# Altium project TIDA-010967_xWRL6432AOP_Module_revB.PrjPcb (part 3 of 3)

## Sheet TIDA-010967_Decoupling_caps.SchDoc: DECOUPLING_CAPS
size 431 x 279 mm; Date: Not shown in title block; ApprovedBy: Not shown in title block; CheckedBy: Not shown in title block; Author: Not shown in title block; CompanyName: Not shown in title block; DrawnBy: Justin Yin; Engineer: Not shown in title block; Organization: Not shown in title block; Address1: Not shown in title block; Address2: Not shown in title block; Address3: Not shown in title block; Address4: Not shown in title block; DocumentNumber: 6; Revision: Use project parameter SCH_Rev; SheetNumber: 6; SheetTotal: 8; PageSetup: Record=PageOptions|CenterHorizontal=True|CenterVertical=True|PrintScale=1.00|XCorrection=1.00|YCorrection=1.00|PrintKind=0|BorderSize=5000000|LeftOffset=0|BottomOffset=0|Orientation=2|PaperLength=1000|PaperWidth=1000|Scale=100|PaperSource=15|PrintQuality=600|MediaType=1|DitherType=10|PaperKind=Letter|PrintScaleMode=1; CurrentTime: Not shown in title block; CurrentDate: Not shown in title block; Time: Not shown in title block; DocumentFullPathAndName: Not shown in title block; DocumentName: Not shown in title block; ModifiedDate: Not shown in title block; ImagePath: Not shown in title block
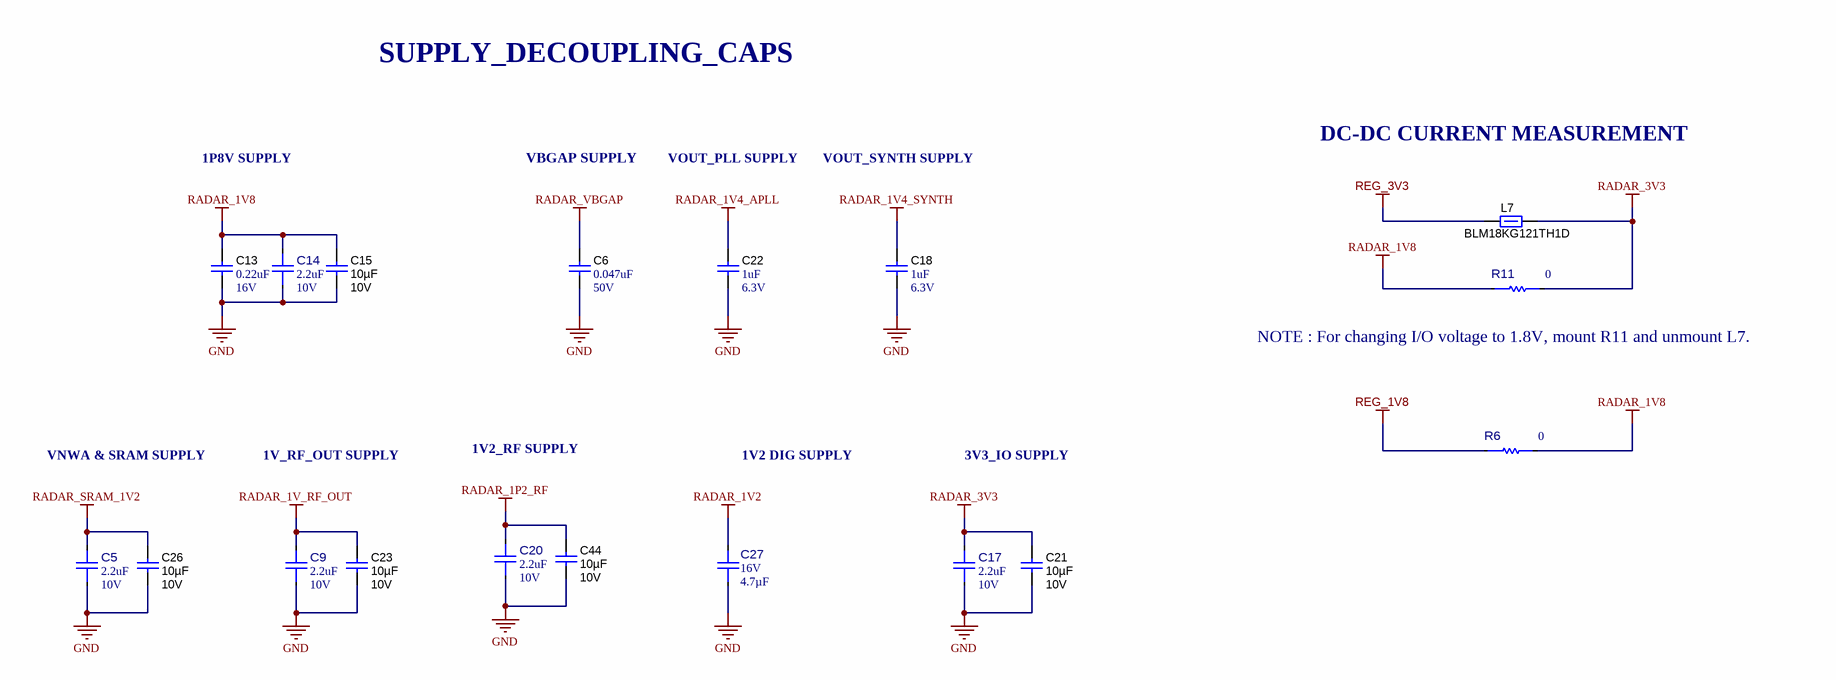
[diagram p5: TIDA-010967_Decoupling_caps.SchDoc]

### Parts
C5  ValueDisplayed: 2.2uF  VDC_V: 10V  [FP-GRM155R61A225ME01D_0402-MFG]  (hidden comment: GRM155R61A225ME01D)
C6  VDC_V: 50V  ValueDisplayed: 0.047uF  [0402L]  (hidden comment: C1005X7R1H473K050BB)
C9  ValueDisplayed: 2.2uF  VDC_V: 10V  [FP-GRM155R61A225ME01D_0402-MFG]  (hidden comment: GRM155R61A225ME01D)
C13  VDC_V: 16V  ValueDisplayed: 0.22uF  [0402L]  (hidden comment: GRM155R71C224KA12D)
C14  ValueDisplayed: 2.2uF  VDC_V: 10V  [FP-GRM155R61A225ME01D_0402-MFG]  (hidden comment: GRM155R61A225ME01D)
C15  Value2: 10V  Cap_F: 10µF  [0603L]  (hidden comment: GRM188Z71A106MA73D)
C17  ValueDisplayed: 2.2uF  VDC_V: 10V  [FP-GRM155R61A225ME01D_0402-MFG]  (hidden comment: GRM155R61A225ME01D)
C18  VDC_V: 6.3V  ValueDisplayed: 1uF  [0402S]  (hidden comment: GRM155R70J105KA12D)
C20  ValueDisplayed: 2.2uF  VDC_V: 10V  [FP-GRM155R61A225ME01D_0402-MFG]  (hidden comment: GRM155R61A225ME01D)
C21  Value2: 10V  Cap_F: 10µF  [0603L]  (hidden comment: GRM188Z71A106MA73D)
C22  VDC_V: 6.3V  ValueDisplayed: 1uF  [0402S]  (hidden comment: GRM155R70J105KA12D)
C23  Value2: 10V  Cap_F: 10µF  [0603L]  (hidden comment: GRM188Z71A106MA73D)
C26  Value2: 10V  Cap_F: 10µF  [0603L]  (hidden comment: GRM188Z71A106MA73D)
C27  VDC_V: 16V  Cap_F: 4.7µF  [FP-GCJ21BR71C475KA01L_0805-MFG]  (hidden comment: GCJ21BR71C475KA01L)
C44  Value2: 10V  Cap_F: 10µF  [0603L]  (hidden comment: GRM188Z71A106MA73D)
L7  BLM18KG121TH1D  [0603L]
R6  Res_ohm: 0  [FP-ERJ-3GEY0R00V_0603-MFG]  (hidden comment: ERJ-3GEY0R00V)
R11  Res_ohm: 0  [FP-ERJ-3GEY0R00V_0603-MFG]  (hidden comment: ERJ-3GEY0R00V)

### Nets
GND: C5.1 C6.2 C9.1 C13.2 C14.1 C15.2 C17.1 C18.2 C20.1 C21.2 C22.2 C23.2 C26.2 C27.1 C44.2
RADAR_1P2_RF: C20.2 C44.1
RADAR_1V2: C27.2
RADAR_1V4_APLL: C22.1
RADAR_1V4_SYNTH: C18.1
RADAR_1V8: C13.1 C14.2 C15.1 R6.2 R11.1
RADAR_1V_RF_OUT: C9.2 C23.1
RADAR_3V3: C17.2 C21.1 L7.2 R11.2
RADAR_SRAM_1V2: C5.2 C26.1
RADAR_VBGAP: C6.1
REG_1V8: R6.1
REG_3V3: L7.1

### Notes on the sheet
- SUPPLY_DECOUPLING_CAPS
- DC-DC CURRENT MEASUREMENT
- 1P8V SUPPLY
- VBGAP SUPPLY
- VOUT_PLL SUPPLY
- VOUT_SYNTH SUPPLY
- (near R11) NOTE : For changing I/O voltage to 1.8V, mount R11 and unmount L7.
- VNWA & SRAM SUPPLY
- 1V_RF_OUT SUPPLY
- 1V2_RF SUPPLY
- 1V2 DIG SUPPLY
- 3V3_IO SUPPLY
- Drawn By:
- SVN Rev:
- Number:
- TID #:
- Orderable:
- Rev:
- Sheet Title:
- File:
- Project Title:
- Designed for:
- Assembly Variant:
- Mod. Date:
- Sheet:
- Size:
- of
- B
- http://www.ti.com
- Texas Instruments and/or its licensors do not warrant the accuracy or completeness of this specification or any information contained therein. Texas Instruments and/or its licensors do not warrant that this design will meet the specifications, will be suitable for your application or fit for any particular purpose, or will operate in an implementation. Texas Instruments and/or its licensors do not warrant that the design is production worthy. You should completely validate and test your design implementation to confirm the system functionality for your application.
- Engineer:
- Contact:
- © Texas Instruments

### Library data of the parts
C5 C9 C14 C17 C20 = CMP-0097887-1: Chip Multilayer Ceramic Capacitors for General Purpose, 0402, 2.2uF, X5R, 15%, 20%, 10V; Manufacturer: Murata; SizeZ_mm: 0.55mm; Value: 2.2µF; AEC Qualified: No; ComponentLink1URL: https://www.murata.com/en-us/products/productdetail?partno=GRM155R61A225ME01%23; PartNumber: GRM155R61A225ME01D; RoHS: TRUE; Temperature Characteristic: X5R; datasheet: https://www.murata.com/en-us/products/productdetail?partno=GRM155R61A225ME01%23; PackageReference: 0402; Part Number: GRM155R61A225ME01D; Lead Free: Yes; Operating Temperature Range: -55°C to +85°C; ComponentLink1Description: Datasheet; Tolerance_%: 20%; helpURL: https://upverter.com/upn/revision/9c1060debce10243/; Datasheet Path: datasheets/Cap-GRM155R61A225ME01D.pdf; TempCo: 15%; Cap_F: 2.2µF
C6 = CMP-0006298-2: CAP, CERM, 0.047 uF, 50 V, +/- 10%, X7R, 0402; Manufacturer: TDK; TaMin_C: -55°C; ESR_ohm: 0.06407; Polarized: N; SizeAreaWB_mm2: 3; Value1: 0.06407 ohm; U/M: EA; SizeZ_mm: 0.6; SizeX_mm: 1; SizeY_mm: 0.5; Cap_Case: 0402; Cap_F: 47nF; IRMS_A: 6.46122dA; AEC Category: Q200; TaMax_C: 125°C; Supplier Part Number 2: 04X3233; Publisher: Texas Instruments; Supplier 2: Newark; Supplier Part Number 3: 810-C1005X7R1H473K; TempCo: X7R; Supplier 3: Mouser; Published: 2008-06-19; RoHS: Y; MountType: SMT; Value: 0.047uF; Supplier 1: Digi-Key; PackageReference: 0402; Tolerance_%: 10%; Value2: 50V; SizeArea_mm2: 0.5; CompType: Capacitor; LatestRevisionDate: 2017-03-09; PartNumber: C1005X7R1H473K050BB; AEC Qualified: N; ComponentLink1Description: Datasheet link; AEC Grade: N/A; Supplier Part Number 1: 445-7336-1-ND; Technology: Ceramic; ComponentLink1URL: https://product.tdk.com/en/search/capacitor/ceramic/mlcc/info?part_no=C1005X7R1H473K050BB
C13 = CMP-0006648-2: CAP, CERM, 0.22 uF, 16 V, +/- 10%, X7R, 0402; Manufacturer: MuRata; TaMin_C: -55°C; Polarized: N; SizeAreaWB_mm2: 3; Value1: Unknown; U/M: EA; Value: 0.22uF; TaMax_C: 125°C; SizeZ_mm: 0.6; SizeX_mm: 1; SizeY_mm: 0.5; Cap_Case: 0402; Cap_F: 220nF; AEC Category: Q200; Supplier Part Number 2: 81-GRM155R71C224KA2D; Publisher: Texas Instruments; Supplier 2: Mouser; TempCo: X7R; Published: 2008-06-19; RoHS: Y; MountType: SMT; Supplier 1: Digi-Key; PackageReference: 0402; Tolerance_%: 10%; Value2: 16V; SizeArea_mm2: 0.5; CompType: Capacitor; LatestRevisionDate: 2017-03-09; PartNumber: GRM155R71C224KA12D; AEC Qualified: ?; ComponentLink1Description: Datasheet link; Supplier Part Number 1: 490-5418-1-ND; Technology: Ceramic; ComponentLink1URL: http://search.murata.co.jp/Ceramy/PnsearchViewAction.do?HnOFG=ON&HnNFG=ON&SEL_CNT=50&sLang=en&sKey=GRM155R71C224KA12D&x=9&y=9&search=startwith
C15 C21 C23 C26 C44 = CMP-0007497-5: CAP, CERM, 10 uF, 10 V, +/- 20%, X7R, 0603; Manufacturer: MuRata; TaMin_C: -55°C; Polarized: N; SizeAreaWB_mm2: 4.68; Value1: Unknown; U/M: EA; Value: 10uF; TaMax_C: 125°C; SizeZ_mm: 1; SizeX_mm: 1.6; SizeY_mm: 0.8; Cap_Case: 0603; SizeArea_mm2: 1.28; AEC Category: Q200; Publisher: Texas Instruments; TempCo: X7R; Published: 2008-06-19; RoHS: Y; MountType: SMT; Supplier 1: Mouser; PackageReference: 0603; Tolerance_%: 20%; CompType: Capacitor; LatestRevisionDate: 2017-03-09; PartNumber: GRM188Z71A106MA73D; AEC Qualified: N; VDC_V: 10V; ComponentLink1Description: Datasheet link; AEC Grade: N/A; Supplier Part Number 1: 81-GRM188Z71A106MA3D; Technology: Ceramic; ValueDisplayed: 10uF; ComponentLink1URL: http://psearch.en.murata.com/capacitor/product/GRM188Z71A106MA73%23.pdf
C18 C22 = CMP-0064947-2: CAP, CERM, 1 uF, 6.3 V,+/- 10%, X7R, 0402; Manufacturer: MuRata; TaMin_C: -55°C; Polarized: N; SizeAreaWB_mm2: 3; Value1: Unknown; U/M: EA; Value: 1uF; TaMax_C: 125°C; SizeZ_mm: 0.6; SizeX_mm: 1; SizeY_mm: 0.5; Cap_Case: 0402; Cap_F: 1µF; AEC Category: Q200; Supplier Part Number 2: 81-GRM155R70J105KA2D; Publisher: Texas Instruments; Supplier 2: Mouser; Supplier Part Number 3: 2688505RL; TempCo: X7R; Supplier 3: Farnell; Published: 2008-06-19; RoHS: Y; MountType: SMT; Supplier 1: Digi-Key; PackageReference: 0402; Tolerance_%: 10%; Value2: 6.3V; SizeArea_mm2: 0.5; CompType: Capacitor; LatestRevisionDate: 2017-06-05; PartNumber: GRM155R70J105KA12D; AEC Qualified: N; ComponentLink1Description: Datasheet link; AEC Grade: N/A; Supplier Part Number 1: 490-10024-1-ND; Technology: Ceramic; ComponentLink1URL: http://search.murata.co.jp/Ceramy/image/img/A01X/G101/ENG/GRM155R70J105KA12-01.pdf
C27 = CMP-0094778-1: Multilayer Ceramic Capacitors MLCC - SMD/SMT 0805 4.7uF 10%, 16VDC,  X7R 15%; Manufacturer: Murata; AEC Qualified: Yes; Value: 4.7µF; AEC Grade: Grade 1; SizeZ_mm: 1.45mm; helpURL: https://upverter.com/upn/revision/6981e148239812b6/; Lead Free: Yes; ComponentLink1URL: https://www.murata.com/en-us/products/productdetail?partno=GCJ21BR71C475KA01%23; RoHS: TRUE; Part Number: GCJ21BR71C475KA01L; PartNumber: GCJ21BR71C475KA01L; TempCo: 15%; Datasheet Path: datasheets/Cap-GCJ21BR71C475KA01L.pdf; Temperature Characteristic: X7R; ComponentLink1Description: Datasheet; Operating Temperature Range: -55°C to +125°C; datasheet: https://www.murata.com/en-us/products/productdetail?partno=GCJ21BR71C475KA01%23; Tolerance_%: 10%; ValueDisplayed: 4.7uF; PackageReference: 0805
L7 = CMP-0077879-2: Ferrite Bead, 120 ohm @ 100 MHz, 1.9 A, 0603; Manufacturer: MuRata; ZTyp@100MHz_Ohm: 120; SizeAreaWB_mm2: 4.68; DCR_ohm: 0.04; Value1: 0.04 ohm; Value: 120 ohm; Imax_A: 1.9A; SizeZ_mm: 1.0; SizeX_mm: 1.6; SizeY_mm: 0.8; SizeArea_mm2: 1.28; ComponentLink1URL: http://www.murata.com/en-global/products/productdata/8796737273886/QNFA9101.pdf; Supplier Part Number 2: 81-BLM18KG121TH1D; Supplier 2: Mouser; RoHS: Y; MountType: SMT; Supplier 1: Digi-Key; PackageReference: 0603; Value2: 1.9A; CompType: Ferrite Bead; PartNumber: BLM18KG121TH1D; ComponentLink1Description: Datasheet link; Supplier Part Number 1: 490-13261-1-ND; ValueDisplayed: 120 ohm
R6 R11 = CMP-0089143-1: 0 Ohms Jumper 0.1W, 1/10W Chip Resistor 0603 (1608 Metric) Automotive AEC-Q200 Thick Film; Manufacturer: Panasonic; SizeZ_mm: 0.55mm; AEC Grade: Grade 0; VDC_V: 75V; TempCo: -100/+600ppm/°C; AEC Qualified: Yes; Power_W: 100mW; Tolerance_%: 5%; Operating Temperature Range: -55°C to +155°C; Device Class L1: Passive Components; Lead Free: Yes; Supplier 2: Mouser; Part Number: ERJ-3GEY0R00V; ComponentLink1URL: https://industrial.panasonic.com/cdbs/www-data/pdf/RDA0000/AOA0000C301.pdf; Datasheet Path: datasheets/Res-ERJ-3GEY0R00V.pdf; Supplier Part Number 1: P0.0GCT-ND; Supplier Part Number 2: 667-ERJ-3GEY0R00V; Device Class L3: Chip SMD Resistors; Supplier 1: Digikey; Digikey Part Number: P0.0GCT-ND; RoHS: TRUE; Series: ERJ; PartNumber: ERJ-3GEY0R00V; datasheet: https://industrial.panasonic.com/cdbs/www-data/pdf/RDA0000/AOA0000C301.pdf; Mouser Description: Resistor, Chip Thick Film, 0 Ohm, 0.1w, Resistor, Chip Thick Film, 0 Ohm, 0.1w, 5%; ComponentLink1Description: Datasheet; helpURL: https://upverter.com/upn/revision/655dc946655e5dbc/; Device Class L2: Resistors; Digikey Description: RES SMD 0 OHM JUMPER 1/10W 0603; Technology: Thick Film; Mouser Part Number: 667-ERJ-3GEY0R00V; PackageReference: 0603

## Sheet TIDA-010967_QSPI_Flash.SchDoc: QSPI_FLASH
size 431 x 279 mm; Date: Not shown in title block; ApprovedBy: Not shown in title block; CheckedBy: Not shown in title block; Author: Not shown in title block; CompanyName: Not shown in title block; DrawnBy: Justin Yin; Engineer: Not shown in title block; Organization: Not shown in title block; Address1: Not shown in title block; Address2: Not shown in title block; Address3: Not shown in title block; Address4: Not shown in title block; DocumentNumber: 7; Revision: Use project parameter SCH_Rev; SheetNumber: 7; SheetTotal: 8; PageSetup: Record=PageOptions|CenterHorizontal=True|CenterVertical=True|PrintScale=1.00|XCorrection=1.00|YCorrection=1.00|PrintKind=0|BorderSize=5000000|LeftOffset=0|BottomOffset=0|Orientation=2|PaperLength=1000|PaperWidth=1000|Scale=100|PaperSource=15|PrintQuality=600|MediaType=1|DitherType=10|PaperKind=Letter|PrintScaleMode=1; CurrentTime: Not shown in title block; CurrentDate: Not shown in title block; Time: Not shown in title block; DocumentFullPathAndName: Not shown in title block; DocumentName: Not shown in title block; ModifiedDate: Not shown in title block; ImagePath: Not shown in title block
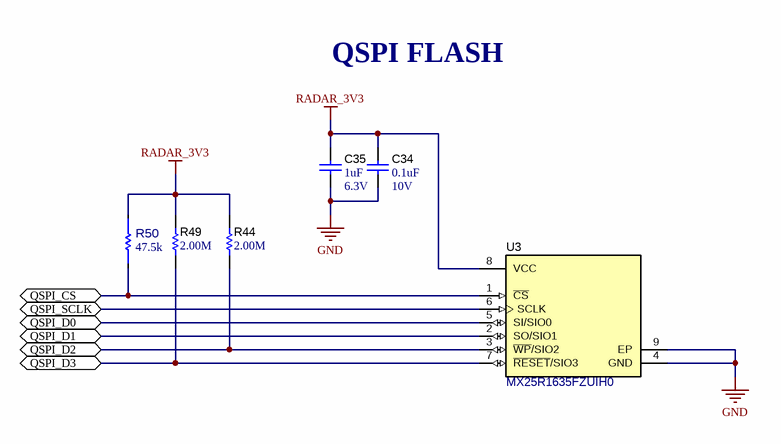
[diagram p6: TIDA-010967_QSPI_Flash.SchDoc]

### Parts
C34  Value2: 10V  ValueDisplayed: 0.1uF  [0201]  (hidden comment: GRM033C71A104KE14D)
C35  VDC_V: 6.3V  ValueDisplayed: 1uF  [0402L]  (hidden comment: GRM155R70J105KA12D)
R44  ValueDisplayed: 2.00M  [0402]  (hidden comment: CRCW04022M00FKED)
R49  ValueDisplayed: 2.00M  [0402]  (hidden comment: CRCW04022M00FKED)
R50  Res_ohm: 47.5k  [FP-AC0402FR-0747K5L_0402-MFG]  (hidden comment: AC0402FR-0747K5L)
U3  MX25R1635FZUIH0  [USON-8L]

### Ports
QSPI_CS (bidir), QSPI_D0 (bidir), QSPI_D1 (bidir), QSPI_D2 (bidir), QSPI_D3 (bidir), QSPI_SCLK (bidir)

### Nets
GND: C34.1 C35.2 U3.4(GND) U3.9(EP)
RADAR_3V3: C34.2 C35.1 R44.2 R49.2 R50.1 U3.8(VCC)
QSPI_CS: R50.2 U3.1(~{CS}) ; port QSPI_CS
QSPI_D0: U3.5(SI/SIO0) ; port QSPI_D0
QSPI_D1: U3.2(SO/SIO1) ; port QSPI_D1
QSPI_D2: R44.1 U3.3(~{WP}/SIO2) ; port QSPI_D2
QSPI_D3: R49.1 U3.7(~{RESET}/SIO3) ; port QSPI_D3
QSPI_SCLK: U3.6(SCLK) ; port QSPI_SCLK

### Notes on the sheet
- QSPI FLASH
- Drawn By:
- SVN Rev:
- Number:
- TID #:
- Orderable:
- Rev:
- Sheet Title:
- File:
- Project Title:
- Designed for:
- Assembly Variant:
- Mod. Date:
- Sheet:
- Size:
- of
- B
- http://www.ti.com
- Texas Instruments and/or its licensors do not warrant the accuracy or completeness of this specification or any information contained therein. Texas Instruments and/or its licensors do not warrant that this design will meet the specifications, will be suitable for your application or fit for any particular purpose, or will operate in an implementation. Texas Instruments and/or its licensors do not warrant that the design is production worthy. You should completely validate and test your design implementation to confirm the system functionality for your application.
- Engineer:
- Contact:
- © Texas Instruments

### Library data of the parts
C34 = CMP-0064969-1: CAP, CERM, 0.1 uF, 10 V,+/- 10%, X7S, 0201; Manufacturer: MuRata; TaMin_C: -55°C; Polarized: N; SizeAreaWB_mm2: 2.08; Value1: Unknown; U/M: EA; Value: 0.1uF; TaMax_C: 125°C; SizeZ_mm: 0.26; SizeX_mm: 0.6; SizeY_mm: 0.3; SizeArea_mm2: 0.18; Cap_F: 100nF; AEC Category: Q200; ComponentLink1URL: http://search.murata.co.jp/Ceramy/image/img/A01X/G101/ENG/GRM033C71A104KE14-01.pdf; Supplier Part Number 2: 81-GRM033C71A104KE4D; Publisher: Texas Instruments; Supplier 2: Mouser; TempCo: X7S; Published: 2008-06-19; RoHS: Y; MountType: SMT; Supplier 1: Digi-Key; PackageReference: 0201; Tolerance_%: 10%; Cap_Case: 0201; CompType: Capacitor; LatestRevisionDate: 2017-06-05; PartNumber: GRM033C71A104KE14D; AEC Qualified: N; VDC_V: 10V; ComponentLink1Description: Datasheet link; AEC Grade: N/A; Supplier Part Number 1: 490-14450-1-ND; Technology: Ceramic
C35 = CMP-0064947-2: as C18 on sheet TIDA-010967_Decoupling_caps; Supplier Part Number 2: 81-GRM155R70J105KA2D; Publisher: Texas Instruments; Supplier 2: Mouser; Supplier Part Number 3: 2688505RL; TempCo: X7R; Supplier 3: Farnell; Published: 2008-06-19; RoHS: Y; MountType: SMT; Supplier 1: Digi-Key; PackageReference: 0402; Tolerance_%: 10%; Value2: 6.3V; SizeArea_mm2: 0.5; CompType: Capacitor; LatestRevisionDate: 2017-06-05; PartNumber: GRM155R70J105KA12D; AEC Qualified: N; ComponentLink1Description: Datasheet link; AEC Grade: N/A; Supplier Part Number 1: 490-10024-1-ND; Technology: Ceramic; ComponentLink1URL: http://search.murata.co.jp/Ceramy/image/img/A01X/G101/ENG/GRM155R70J105KA12-01.pdf
R44 R49 = CMP-0026245-2: RES, 2.00 M, 1%, 0.063 W, AEC-Q200 Grade 0, 0402; Manufacturer: Vishay-Dale; Power_W: 63mW; TempCo: 100 ppm/C; Value_Code: 2M00; Value: 2.00Meg; EIA_Code: E96; Res_ohm: 2M; SizeX_mm: 1; SizeY_mm: 0.5; SizeZ_mm: 0.6; Value2: 0.063W; AEC Qualified: Y; VDC_V: 50V; AEC Category: Q200; AEC Grade: 0; ComponentLink1URL: http://www.vishay.com/docs/20035/dcrcwe3.pdf; Supplier Part Number 2: 52K6816; Supplier 2: Newark; Supplier Part Number 3: 71-CRCW0402-2M-E3; Supplier 3: Mouser; RoHS: E; Value1: 1%; MountType: SMT; Supplier 1: Digi-Key; PackageReference: 0402; Tolerance_%: 1%; SizeArea_mm2: 0.5; CompType: Resistor; PartNumber: CRCW04022M00FKED; ComponentLink1Description: Datasheet link; Supplier Part Number 1: 541-2.00MLCT-ND; Technology: Thick Film
R50 = CMP-0095013-1: Res Thick Film 0402 47.5K Ohm 1% 1/16W ±100ppm/°C Molded SMD Paper T/R; Manufacturer: Yageo; VDC_V: 50V; SizeZ_mm: 0.37mm; AEC Grade: Grade 0; Power_W: 62.5mW; AEC Qualified: Yes; Digikey Part Number: 13-AC0402FR-0747K5LCT-ND; Supplier 1: Digikey; Technology: Thick Film; ComponentLink1URL: https://www.yageo.com/upload/media/product/productsearch/datasheet/rchip/PYu-AC_51_RoHS_L_8.pdf; Tolerance_%: 1%; Mouser Part Number: 603-AC0402FR-0747K5L; Part Number: AC0402FR-0747K5L; RoHS: TRUE; Value: 47.5k; datasheet: https://www.yageo.com/upload/media/product/productsearch/datasheet/rchip/PYu-AC_51_RoHS_L_8.pdf; Supplier Part Number 2: 603-AC0402FR-0747K5L; Lead Free: Yes; helpURL: https://upverter.com/upn/revision/53eb058114c18d9e/; TempCo: 100ppm/°C; Supplier Part Number 1: 13-AC0402FR-0747K5LCT-ND; PackageReference: 0402; Operating Temperature Range: -55°C to +155°C; Series: AC; Mouser Description: Thick Film Resistors - SMD 1/16W 47.5K ohm 1% AEC-Q200; Supplier 2: Mouser; Datasheet Path: datasheets/Res-AC0402FR-0747K5L.pdf; ComponentLink1Description: Datasheet; Digikey Description: RES SMD 47.5K OHM 1% 1/16W 0402; PartNumber: AC0402FR-0747K5L
U3 = CMP-0078466-1: ULTRA LOW POWER, 16M-BIT [x 1/x 2/x 4] CMOS MXSMIO (SERIAL MULTI I/O) FLASH MEMORY, SON-8; Manufacturer: Macronix International Co., LTD; SizeArea_mm2: 6; SizeAreaWB_mm2: 12; SizeY_mm: 2; SizeZ_mm: 0.6; SizeX_mm: 3; PartNumber: MX25R1635FZUIH0; PackageReference: SON-8; Supplier Part Number 1: 1092-1178-1-ND; ComponentLink1Description: Datasheet URL; MountType: SMT; ComponentLink1URL: http://www.macronix.com/Lists/Datasheet/Attachments/6257/MX25R1635F,%20Wide%20Range,%2016Mb,%20v1.5.pdf; Supplier 1: Digi-Key; RoHS: Y

## Sheet TIDA-010967_Hardware.SchDoc: HARDWARE
size 431 x 279 mm; Date: Not shown in title block; ApprovedBy: Not shown in title block; CheckedBy: Not shown in title block; Author: Not shown in title block; CompanyName: Not shown in title block; DrawnBy: Justin Yin; Engineer: Not shown in title block; Organization: Not shown in title block; Address1: Not shown in title block; Address2: Not shown in title block; Address3: Not shown in title block; Address4: Not shown in title block; DocumentNumber: 8; Revision: Use project parameter SCH_Rev; SheetNumber: 8; SheetTotal: 8; PageSetup: Record=PageOptions|CenterHorizontal=True|CenterVertical=True|PrintScale=1.00|XCorrection=1.00|YCorrection=1.00|PrintKind=0|BorderSize=5000000|LeftOffset=0|BottomOffset=0|Orientation=2|PaperLength=1000|PaperWidth=1000|Scale=100|PaperSource=15|PrintQuality=600|MediaType=1|DitherType=10|PaperKind=Letter|PrintScaleMode=1; CurrentTime: Not shown in title block; CurrentDate: Not shown in title block; Time: Not shown in title block; DocumentFullPathAndName: Not shown in title block; DocumentName: Not shown in title block; ModifiedDate: Not shown in title block; ImagePath: Not shown in title block
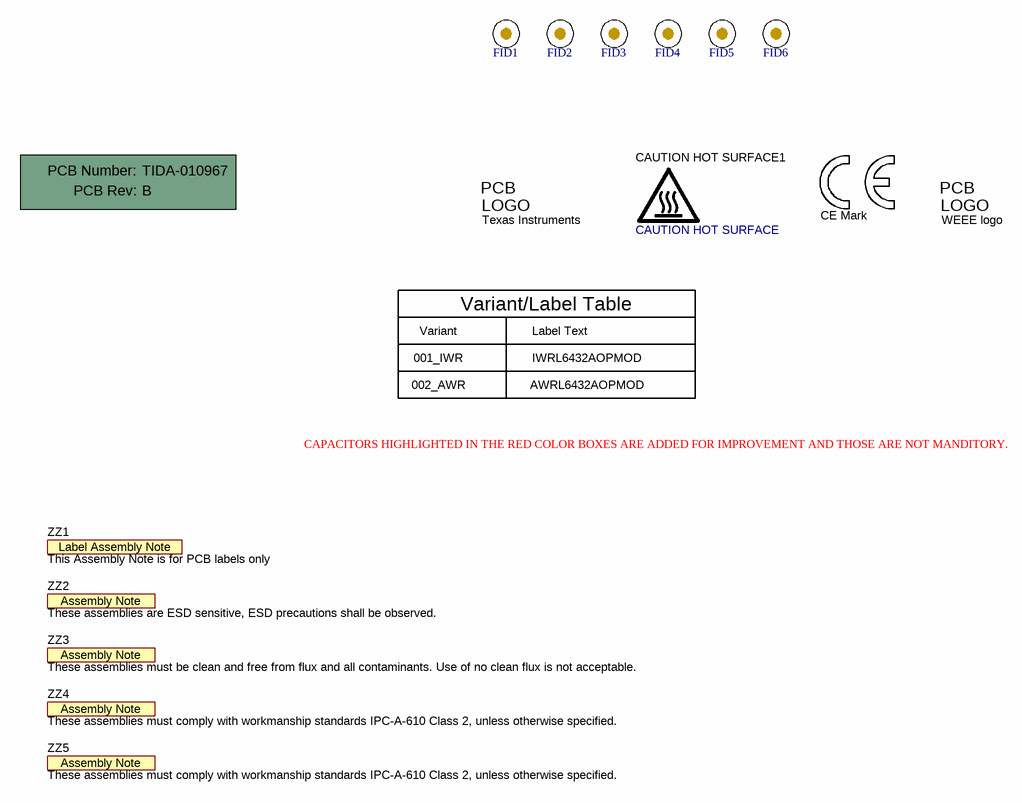
[diagram p7: TIDA-010967_Hardware.SchDoc]

### Parts
!PCB  Printed Circuit Board  (value not drawn)  (mechanical)
CAUTION_HOT_SURFACE1  CAUTION HOT SURFACE  [IEC_HotSurface_Small]  (no BOM)
FID1  Fiducial  [Fiducial10-20]  (value not drawn)
FID2  Fiducial  [Fiducial10-20]  (value not drawn)
FID3  Fiducial  [Fiducial10-20]  (value not drawn)
FID4  Fiducial  [Fiducial10-20]  (value not drawn)
FID5  Fiducial  [Fiducial10-20]  (value not drawn)
FID6  Fiducial  [Fiducial10-20]  (value not drawn)
Logo1  Texas Instruments  [TI_Symbol_Overlay_Small]  (no BOM)
Logo2  CE Mark  [CE_Mark_3MM5]  (no BOM)
Logo4  WEEE logo  [WEEE_Minimum]  (no BOM)
ZZ1  This Assembly Note is for PCB labels only  [AssemblyNoteLabel]  (no BOM)
ZZ2  These assemblies are ESD sensitive, ESD precautions shall be observed.  [AssemblyNote]  (no BOM)
ZZ3  These assemblies must be clean and free from flux and all contaminants. Use of no clean flux is not acceptable.  [AssemblyNote]  (no BOM)
ZZ4  These assemblies must comply with workmanship standards IPC-A-610 Class 2, unless otherwise specified.  [AssemblyNote]  (no BOM)
ZZ5  These assemblies must comply with workmanship standards IPC-A-610 Class 2, unless otherwise specified.  [AssemblyNote]  (no BOM)

### Notes on the sheet
- Variant
- 001_IWR
- Variant/Label Table
- Label Text
- IWRL6432AOPMOD
- 002_AWR
- AWRL6432AOPMOD
- CAPACITORS HIGHLIGHTED IN THE RED COLOR BOXES ARE ADDED FOR IMPROVEMENT AND THOSE ARE NOT MANDITORY.
- Drawn By:
- SVN Rev:
- Number:
- TID #:
- Orderable:
- Rev:
- Sheet Title:
- File:
- Project Title:
- Designed for:
- Assembly Variant:
- Mod. Date:
- Sheet:
- Size:
- of
- B
- http://www.ti.com
- Texas Instruments and/or its licensors do not warrant the accuracy or completeness of this specification or any information contained therein. Texas Instruments and/or its licensors do not warrant that this design will meet the specifications, will be suitable for your application or fit for any particular purpose, or will operate in an implementation. Texas Instruments and/or its licensors do not warrant that the design is production worthy. You should completely validate and test your design implementation to confirm the system functionality for your application.
- Engineer:
- Contact:
- © Texas Instruments
- (in symbol CMP-0003616-3) Label Assembly Note
- (in symbol CMP-0003618-2) PCB Number:; PCB Rev:
- (in symbol CMP-0074769-1) PCB; LOGO
- (in symbol CMP-0074838-1) PCB; LOGO

### Library data of the parts
!PCB = CMP-0003618-2: Manufacturer: Any; PartNumber: TIDA-010967; CompType: PCB; RoHS: O; MountType: N/A; Publisher: Texas Instruments; LatestRevisionDate: 2017-03-09; Key: PCB
CAUTION_HOT_SURFACE1 = CMP-0074837-2: IEC 61010-1 Hot Surface Warning; Manufacturer: Texas Instruments; SymbolCreator: a0412235; AEC Category: Q200; CompType: IC; Library Reference: IEC_HotSurface; Publisher: Texas Instruments; SymbolVersion: 2011-08-22; Published: 2009-03-03; Lib Reference: IEC_HotSurface; LatestRevisionDate: 2017-07-06; PartNumber: CAUTION HOT SURFACE; ComponentLink1Description: Datasheet Link; ComponentLink1URL: http://www.ti.com/lit/ds/symlink/GPN.pdf; ComponentLink2Description: Product Folder; ComponentLink2URL: http://www.ti.com/product/GPN; ComponentLink3Description: Online Datasheet; ComponentLink3URL: http://www.ti.com/product/GPN/datasheet
FID1-FID6 = CMP-0077181-1: Fiducial mark.  There is nothing to buy or mount.; CompType: Fiducial; Manufacturer: N/A; MountType: N/A; PackageReference: N/A; PartNumber: N/A; ClassName: FiducialMark; Library Reference: Fiducial
Logo1 = CMP-0074838-1: Texas Instrument Corporate Signature; SymbolCreator: a0412235; Lib Reference: TI_Logo; SymbolVersion: 2011-08-22; Published: 2009-03-03; Publisher: Texas Instruments; ClassName: Logo; LatestRevisionDate: 2017-07-06; PartNumber: Texas Instruments; Library Reference: Logo
Logo2 = CMP-0074844-2: Manufacturer: Texas Instruments; SymbolCreator: a0412235; AEC Category: Q200; CompType: IC; Published: 2009-03-03; Publisher: Texas Instruments; LatestRevisionDate: 2017-07-06; Lib Reference: CE Mark; PartNumber: CE Mark; Library Reference: CE Mark; ComponentLink1Description: Datasheet Link; ComponentLink1URL: http://www.ti.com/lit/ds/symlink/GPN.pdf; ComponentLink2Description: Product Folder; ComponentLink2URL: http://www.ti.com/product/GPN; ComponentLink3Description: Online Datasheet; ComponentLink3URL: http://www.ti.com/product/GPN/datasheet
Logo4 = CMP-0074769-1: Library Reference: WEEE logo; Lib Reference: WEEE logo; PartNumber: WEEE logo
ZZ1 = CMP-0003616-3: CompType: AssemblyNote; ClassName: AssemblyNote; Publisher: Texas Instruments; LatestRevisionDate: 2017-03-09; Key: AssemblyNoteLabel
ZZ2 = CMP-0077236-1: CompType: AssemblyNote; ClassName: AssemblyNote; Publisher: Texas Instruments; LatestRevisionDate: 2017-08-10; Key: AssemblyNote
ZZ3 = CMP-0077237-1: CompType: AssemblyNote; ClassName: AssemblyNote; Publisher: Texas Instruments; LatestRevisionDate: 2017-08-10; Key: AssemblyNote
ZZ4 ZZ5 = CMP-0077238-1: CompType: AssemblyNote; ClassName: AssemblyNote; Publisher: Texas Instruments; LatestRevisionDate: 2017-08-10; Key: AssemblyNote

## Nets that join several sheets
5V_IN_USB: TIDA-010967_USB_PWR_Connector (11 pins), TIDA-010967_DC_Regulators (5 pins)
GND: TIDA-010967_USB_PWR_Connector (33 pins), TIDA-010967_DC_Regulators (34 pins), TIDA-010967_xWRL6432_Chip (41 pins), TIDA-010967_Decoupling_caps (15 pins), TIDA-010967_QSPI_Flash (C34.1 C35.2 U3.4 U3.9)
OUT_3V3: TIDA-010967_USB_PWR_Connector (J1.1 J1.2 J1.4 J22.1), TIDA-010967_DC_Regulators (6 pins)
RADAR_1P2_RF: TIDA-010967_xWRL6432_Chip (5 pins), TIDA-010967_Decoupling_caps (C20.2 C44.1)
RADAR_1V2: TIDA-010967_xWRL6432_Chip (TP13.1 U6.K2), TIDA-010967_Decoupling_caps (C27.2)
RADAR_1V4_APLL: TIDA-010967_xWRL6432_Chip (U6.G8), TIDA-010967_Decoupling_caps (C22.1)
RADAR_1V4_SYNTH: TIDA-010967_xWRL6432_Chip (U6.F7), TIDA-010967_Decoupling_caps (C18.1)
RADAR_1V8: TIDA-010967_xWRL6432_Chip (17 pins), TIDA-010967_Decoupling_caps (5 pins)
RADAR_1V_RF_OUT: TIDA-010967_xWRL6432_Chip (5 pins), TIDA-010967_Decoupling_caps (C9.2 C23.1)
RADAR_3V3: TIDA-010967_USB_PWR_Connector (C39.1 R12.1 R19.2 U4.3), TIDA-010967_DC_Regulators (R175.1 TP9.1), TIDA-010967_xWRL6432_Chip (8 pins), TIDA-010967_Decoupling_caps (C17.2 C21.1 L7.2 R11.2), TIDA-010967_QSPI_Flash (6 pins)
RADAR_SRAM_1V2: TIDA-010967_xWRL6432_Chip (U6.M1 U6.M2 U6.N2), TIDA-010967_Decoupling_caps (C5.2 C26.1)
RADAR_VBGAP: TIDA-010967_xWRL6432_Chip (U6.H10), TIDA-010967_Decoupling_caps (C6.1)
REG_1V8: TIDA-010967_DC_Regulators (C11.1 L6.2 TP2.1), TIDA-010967_Decoupling_caps (R6.1)
REG_3V3: TIDA-010967_DC_Regulators (13 pins), TIDA-010967_Decoupling_caps (L7.1)
REG_OUT_1V8: TIDA-010967_USB_PWR_Connector (J24.1), TIDA-010967_DC_Regulators (6 pins)
USB_INPUT_3V3: TIDA-010967_USB_PWR_Connector (J30.1), TIDA-010967_DC_Regulators (5 pins)
GPIO_2: TIDA-010967_USB_PWR_Connector (J8.1), TIDA-010967_xWRL6432_Chip (U6.H2)
GPIO_4: TIDA-010967_DC_Regulators (R7.1), TIDA-010967_xWRL6432_Chip (U6.J4)
HOST_INTR_GPIO_5: TIDA-010967_USB_PWR_Connector (J4.1), TIDA-010967_xWRL6432_Chip (R24.2 U6.J2)
QSPI_CS: TIDA-010967_xWRL6432_Chip (U6.D3), TIDA-010967_QSPI_Flash (R50.2 U3.1)
QSPI_D0: TIDA-010967_xWRL6432_Chip (U6.C2), TIDA-010967_QSPI_Flash (U3.5)
QSPI_D1: TIDA-010967_xWRL6432_Chip (U6.C3), TIDA-010967_QSPI_Flash (U3.2)
QSPI_D2: TIDA-010967_xWRL6432_Chip (U6.C4), TIDA-010967_QSPI_Flash (R44.1 U3.3)
QSPI_D3: TIDA-010967_xWRL6432_Chip (U6.B3 U6.B4), TIDA-010967_QSPI_Flash (R49.1 U3.7)
QSPI_SCLK: TIDA-010967_xWRL6432_Chip (U6.D2), TIDA-010967_QSPI_Flash (U3.6)
RADAR_NRST: TIDA-010967_USB_PWR_Connector (J1.3 J3.1), TIDA-010967_DC_Regulators (R176.1), TIDA-010967_xWRL6432_Chip (C48.2 R165.1 U6.M3 U6.M4)
REG_MODE_SELECT: TIDA-010967_USB_PWR_Connector (J26.1), TIDA-010967_DC_Regulators (6 pins)
RS232_RX: TIDA-010967_USB_PWR_Connector (J1.9 J7.1 J27.1 R17.1), TIDA-010967_xWRL6432_Chip (R74.2 U6.G2)
RS232_TX: TIDA-010967_USB_PWR_Connector (J1.11 J5.1 J31.1 R18.1), TIDA-010967_xWRL6432_Chip (R73.2 U6.H4)
SPI_CLK_I2C_SCL: TIDA-010967_USB_PWR_Connector (J1.20 J13.1), TIDA-010967_xWRL6432_Chip (R75.2 U6.F1)
SPI_CS_I2C_SDA: TIDA-010967_USB_PWR_Connector (J1.17 J15.1), TIDA-010967_xWRL6432_Chip (R4.2 U6.F4)
SPI_MISO_REG_MODE: TIDA-010967_USB_PWR_Connector (J1.19 J17.1), TIDA-010967_xWRL6432_Chip (U6.E4)
SPI_MOSI: TIDA-010967_USB_PWR_Connector (J1.21 J19.1), TIDA-010967_xWRL6432_Chip (U6.E3)
TCK: TIDA-010967_USB_PWR_Connector (J10.1), TIDA-010967_xWRL6432_Chip (TP17.1 U6.F3)
TDI: TIDA-010967_USB_PWR_Connector (J14.1), TIDA-010967_xWRL6432_Chip (TP18.1 U6.F2)
TDO_SOP0: TIDA-010967_USB_PWR_Connector (J1.15 J12.1 R20.1), TIDA-010967_xWRL6432_Chip (R22.1)
TMS: TIDA-010967_USB_PWR_Connector (J6.1), TIDA-010967_xWRL6432_Chip (TP19.1 U6.G3)
UARTA_RX: TIDA-010967_USB_PWR_Connector (J11.1), TIDA-010967_xWRL6432_Chip (U6.J3)
UARTA_TX: TIDA-010967_USB_PWR_Connector (J9.1), TIDA-010967_xWRL6432_Chip (U6.K3)

## Assembly variants
001_IWR: not fitted C2 C19 FID1 FID2 FID3 FID4 FID5 FID6 R2 R11 R12 R23 R24
002_AWR: not fitted C2 C19 FID1 FID2 FID3 FID4 FID5 FID6 R2 R11 R12 R23 R24